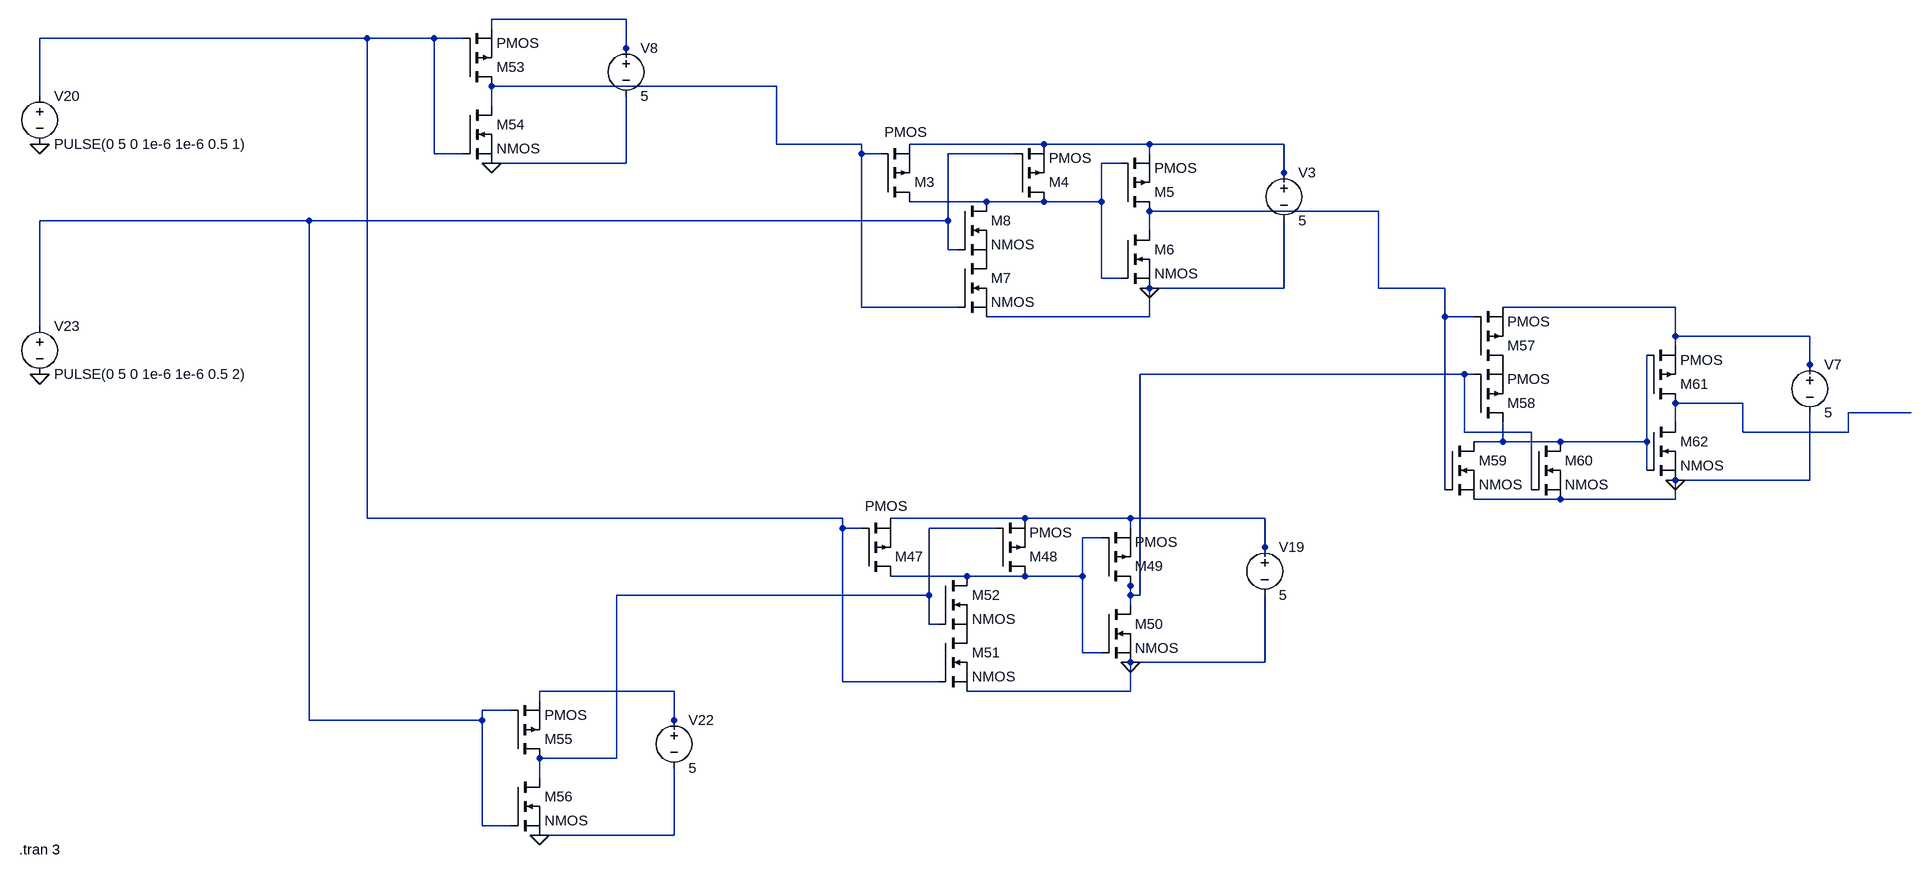
[diagram p0: schematic XOR.asc]
XOR.asc, the LTspice schematic file:
Version 4
SHEET 1 6508 1156
WIRE -128 -3088 -352 -3088
WIRE -352 -3072 -352 -3088
WIRE -560 -3056 -1184 -3056
WIRE -448 -3056 -560 -3056
WIRE -400 -3056 -448 -3056
WIRE -128 -3040 -128 -3088
WIRE -128 -3024 -128 -3040
WIRE -352 -2976 -352 -2992
WIRE 128 -2976 -352 -2976
WIRE -1184 -2960 -1184 -3056
WIRE -352 -2944 -352 -2976
WIRE 128 -2880 128 -2976
WIRE 288 -2880 128 -2880
WIRE 592 -2880 368 -2880
WIRE 768 -2880 592 -2880
WIRE 992 -2880 768 -2880
WIRE -448 -2864 -448 -3056
WIRE -400 -2864 -448 -2864
WIRE 288 -2864 288 -2880
WIRE 320 -2864 288 -2864
WIRE 544 -2864 432 -2864
WIRE 768 -2864 768 -2880
WIRE -128 -2848 -128 -2960
WIRE -128 -2848 -352 -2848
WIRE 720 -2848 688 -2848
WIRE 992 -2832 992 -2880
WIRE 992 -2816 992 -2832
WIRE 496 -2784 368 -2784
WIRE 592 -2784 496 -2784
WIRE 688 -2784 688 -2848
WIRE 688 -2784 592 -2784
WIRE 768 -2768 768 -2784
WIRE 1216 -2768 768 -2768
WIRE -656 -2752 -1184 -2752
WIRE 432 -2752 432 -2864
WIRE 432 -2752 -656 -2752
WIRE 768 -2736 768 -2768
WIRE 432 -2704 432 -2752
WIRE 448 -2704 432 -2704
WIRE 688 -2656 688 -2784
WIRE 720 -2656 688 -2656
WIRE 992 -2640 992 -2752
WIRE 992 -2640 768 -2640
WIRE 1216 -2640 1216 -2768
WIRE 1344 -2640 1216 -2640
WIRE 288 -2608 288 -2864
WIRE 448 -2608 288 -2608
WIRE 1728 -2608 1440 -2608
WIRE 768 -2592 768 -2640
WIRE 768 -2592 496 -2592
WIRE 1344 -2592 1344 -2640
WIRE 1392 -2592 1344 -2592
WIRE -1184 -2576 -1184 -2752
WIRE 1728 -2560 1728 -2608
WIRE 1952 -2560 1728 -2560
WIRE 1728 -2544 1728 -2560
WIRE 1952 -2512 1952 -2560
WIRE 1376 -2496 752 -2496
WIRE 1392 -2496 1376 -2496
WIRE 1952 -2496 1952 -2512
WIRE 1728 -2448 1728 -2464
WIRE 1840 -2448 1728 -2448
WIRE 2976 -2432 2016 -2432
WIRE 1728 -2416 1728 -2448
WIRE 1376 -2400 1376 -2496
WIRE 1488 -2400 1376 -2400
WIRE 1840 -2400 1840 -2448
WIRE 2016 -2400 2016 -2432
WIRE 2016 -2400 1840 -2400
WIRE 1440 -2384 1440 -2416
WIRE 1440 -2384 1392 -2384
WIRE 1536 -2384 1440 -2384
WIRE 1680 -2384 1680 -2528
WIRE 1680 -2384 1536 -2384
WIRE 1680 -2336 1680 -2384
WIRE 1952 -2320 1952 -2432
WIRE 1952 -2320 1728 -2320
WIRE 1344 -2304 1344 -2592
WIRE 1488 -2304 1488 -2400
WIRE 1536 -2288 1392 -2288
WIRE 1728 -2288 1728 -2320
WIRE 1728 -2288 1536 -2288
WIRE -560 -2256 -560 -3056
WIRE 256 -2256 -560 -2256
WIRE 560 -2256 336 -2256
WIRE 736 -2256 560 -2256
WIRE 960 -2256 736 -2256
WIRE 256 -2240 256 -2256
WIRE 288 -2240 256 -2240
WIRE 512 -2240 400 -2240
WIRE 736 -2240 736 -2256
WIRE 688 -2224 656 -2224
WIRE 960 -2208 960 -2256
WIRE 960 -2192 960 -2208
WIRE 464 -2160 336 -2160
WIRE 560 -2160 464 -2160
WIRE 656 -2160 656 -2224
WIRE 656 -2160 560 -2160
WIRE 736 -2144 736 -2160
WIRE 400 -2128 400 -2240
WIRE 400 -2128 -144 -2128
WIRE 736 -2128 736 -2144
WIRE 752 -2128 752 -2496
WIRE 752 -2128 736 -2128
WIRE 736 -2112 736 -2128
WIRE 400 -2080 400 -2128
WIRE 416 -2080 400 -2080
WIRE 656 -2032 656 -2160
WIRE 688 -2032 656 -2032
WIRE 960 -2016 960 -2128
WIRE 960 -2016 736 -2016
WIRE 256 -1984 256 -2240
WIRE 416 -1984 256 -1984
WIRE -48 -1968 -272 -1968
WIRE 736 -1968 736 -2016
WIRE 736 -1968 464 -1968
WIRE -272 -1952 -272 -1968
WIRE -320 -1936 -368 -1936
WIRE -656 -1920 -656 -2752
WIRE -368 -1920 -368 -1936
WIRE -368 -1920 -656 -1920
WIRE -48 -1920 -48 -1968
WIRE -48 -1904 -48 -1920
WIRE -272 -1856 -272 -1872
WIRE -144 -1856 -144 -2128
WIRE -144 -1856 -272 -1856
WIRE -272 -1824 -272 -1856
WIRE -368 -1744 -368 -1920
WIRE -320 -1744 -368 -1744
WIRE -48 -1728 -48 -1840
WIRE -48 -1728 -272 -1728
FLAG 768 -2640 0
FLAG 736 -2016 0
FLAG -352 -2848 0
FLAG -272 -1728 0
FLAG 1728 -2320 0
FLAG -1184 -2880 0
FLAG -1184 -2496 0
SYMBOL pmos 320 -2784 M180
WINDOW 3 6 116 Left 2
SYMATTR InstName M3
SYMBOL pmos 544 -2784 M180
SYMATTR InstName M4
SYMBOL pmos 720 -2768 M180
SYMATTR InstName M5
SYMBOL nmos 720 -2736 R0
SYMATTR InstName M6
SYMBOL voltage 992 -2848 R0
WINDOW 123 0 0 Left 2
WINDOW 39 0 0 Left 2
SYMATTR InstName V3
SYMATTR Value 5
SYMBOL nmos 448 -2688 R0
SYMATTR InstName M7
SYMBOL nmos 448 -2784 R0
SYMATTR InstName M8
SYMBOL pmos 288 -2160 M180
WINDOW 3 6 116 Left 2
SYMATTR InstName M47
SYMBOL pmos 512 -2160 M180
SYMATTR InstName M48
SYMBOL pmos 688 -2144 M180
SYMATTR InstName M49
SYMBOL nmos 688 -2112 R0
SYMATTR InstName M50
SYMBOL voltage 960 -2224 R0
WINDOW 123 0 0 Left 2
WINDOW 39 0 0 Left 2
SYMATTR InstName V19
SYMATTR Value 5
SYMBOL nmos 416 -2064 R0
SYMATTR InstName M51
SYMBOL nmos 416 -2160 R0
SYMATTR InstName M52
SYMBOL pmos -400 -2976 M180
SYMATTR InstName M53
SYMBOL nmos -400 -2944 R0
SYMATTR InstName M54
SYMBOL voltage -128 -3056 R0
WINDOW 123 0 0 Left 2
WINDOW 39 0 0 Left 2
SYMATTR InstName V8
SYMATTR Value 5
SYMBOL pmos -320 -1856 M180
SYMATTR InstName M55
SYMBOL nmos -320 -1824 R0
SYMATTR InstName M56
SYMBOL voltage -48 -1936 R0
WINDOW 123 0 0 Left 2
WINDOW 39 0 0 Left 2
SYMATTR InstName V22
SYMATTR Value 5
SYMBOL voltage -1184 -2976 R0
WINDOW 123 0 0 Left 2
WINDOW 39 0 0 Left 2
SYMATTR InstName V20
SYMATTR Value PULSE(0 5 0 1e-6 1e-6 0.5 1)
SYMBOL voltage -1184 -2592 R0
WINDOW 123 0 0 Left 2
WINDOW 39 0 0 Left 2
SYMATTR InstName V23
SYMATTR Value PULSE(0 5 0 1e-6 1e-6 0.5 2)
SYMBOL pmos 1392 -2512 M180
SYMATTR InstName M57
SYMBOL pmos 1392 -2416 M180
SYMATTR InstName M58
SYMBOL nmos 1344 -2384 R0
SYMATTR InstName M59
SYMBOL nmos 1488 -2384 R0
SYMATTR InstName M60
SYMBOL pmos 1680 -2448 M180
SYMATTR InstName M61
SYMBOL nmos 1680 -2416 R0
SYMATTR InstName M62
SYMBOL voltage 1952 -2528 R0
WINDOW 123 0 0 Left 2
WINDOW 39 0 0 Left 2
SYMATTR InstName V7
SYMATTR Value 5
TEXT -1218 -1704 Left 2 !.tran 3

The netlist it stands for:
* XOR.asc
M3 N006 N003 N004 N004 PMOS
M4 N006 N005 N004 N004 PMOS
M5 N007 N006 N004 N004 PMOS
M6 N007 N006 0 0 NMOS
V3 N004 0 5
M7 P001 N003 0 0 NMOS
M8 N006 N005 P001 P001 NMOS
M47 N014 N002 N012 N012 PMOS
M48 N014 N013 N012 N012 PMOS
M49 N009 N014 N012 N012 PMOS
M50 N009 N014 0 0 NMOS
V19 N012 0 5
M51 P002 N002 0 0 NMOS
M52 N014 N013 P002 P002 NMOS
M53 N003 N002 N001 N001 PMOS
M54 N003 N002 0 0 NMOS
V8 N001 0 5
M55 N013 N005 N015 N015 PMOS
M56 N013 N005 0 0 NMOS
V22 N015 0 5
V20 N002 0 PULSE(0 5 0 1e-6 1e-6 0.5 1)
V23 N005 0 PULSE(0 5 0 1e-6 1e-6 0.5 2)
M57 P003 N007 N008 N008 PMOS
M58 N011 N009 P003 P003 PMOS
M59 N011 N007 0 0 NMOS
M60 N011 N009 0 0 NMOS
M61 N010 N011 N008 N008 PMOS
M62 N010 N011 0 0 NMOS
V7 N008 0 5
.model NMOS NMOS
.model PMOS PMOS
.lib standard.mos
.tran 3
.backanno
.end